# Altium schematic sheet Lightrelayproject.SchDoc
size A; SheetNumber: 1; SheetTotal: 1
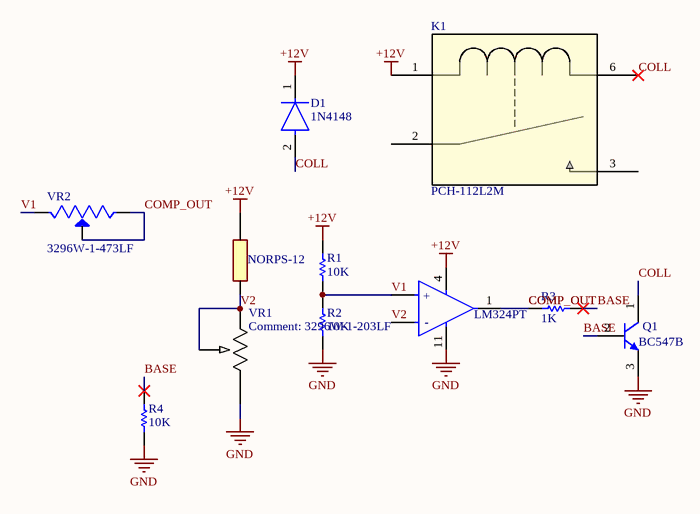
[diagram p0: Lightrelayproject.SchDoc]

## Parts
D1  1N4148  [FP-017AG-MFG]
K1  PCH-112L2M  [RELAY_PCH-1A_TYC]
Q1  BC547B  [ONSC-TO-92-3-29-11]
R1  value 10K  [YAG_CFR25_YAG]  (hidden comment: Resistor)
R2  value 10K  [YAG_CFR25_YAG]  (hidden comment: Resistor)
R3  value 1K  [YAG_CFR25_YAG]  (hidden comment: Resistor)
R4  value 10K  [YAG_CFR25_YAG]  (hidden comment: Resistor)
U1  LM324PT  [FP-TSSOP14-IPC_C]  (part A of 4)
VR1  3296W-1-203LF  [POT_3296W]
VR2  3296W-1-473LF  [TRIM_3296W-1-473LF]
X1  NORPS-12  [NORPS12]

## Nets
+12V: D1.1(C) K1.1 R1.2 U1.4(VCC+) X1.2
GND: Q1.3(E) R2.1 R4.1 U1.11(VCC-) VR1.1
BASE: Q1.2(B) R3.2 R4.2
COLL: D1.2(A) K1.6 Q1.1(C)
COMP_OUT: R3.1 U1.1(Output_1) VR2.1(CCW) VR2.2(WIPER)
V1: R1.1 R2.2 U1.3(Non-inverting_input_1) VR2.3(CW)
V2: U1.2(Inverting_input_1) VR1.2 VR1.3 X1.1

Not connected (* = marked no-connect by the designer): K1 2 3

## Notes on the sheet
- (in symbol CMP-12131-000012-2, part A) +

## Library data of the parts
D1 = CMP-07163-000046-1: DIODE GEN PURP 100V 200MA DO35; Forward Voltage: 1V; Max Power Dissipation: 500mW; Max Reverse Current: 5uA; Forward Current: 300mA; Current: 4A; Reverse Recovery Time: 4ns; Element Configuration: Single; Outside Diameter: 1.85mm; Capacitance: 4pF; Polarity: Standard; Max Forward Surge Current (Ifsm): 1A; Reverse Voltage: 100V; Output Current: 200mA; Average Rectified Current: 200mA; Diameter: 1.91mm; Max Repetitive Reverse Voltage (Vrrm): 100V; Current Rating: 200mA; Case/Package: DO-35; Lead Free: Lead Free; Number of Pins: 2; Recovery Time: 4ns; Packaging: Bulk; Contact Plating: Tin; Voltage: 100V; Mount: Through Hole; Max Surge Current: 4A; Package Quantity: 2000; Width: 1.91mm; Max Reverse Voltage (DC): 100V; Length: 4.56mm; Radiation Hardening: No; Power Dissipation: 500mW; Voltage Rating (DC): 100V; Peak Non-Repetitive Surge Current: 4A; REACH SVHC: No SVHC; Height: 4.56mm; Max Operating Temperature: 175°C; Series: -; Weight: 0.01lb; Min Operating Temperature: -65°C
K1 = PCH-112L2M: Description; Manufacturer_Name: TE Connectivity; Copyright: Copyright (C) 2025 Ultra Librarian. All rights reserved.; Manufacturer_Part_Number: PCH-112L2M; RefDes: RefDes; Type: Type
Q1 = CMP-1048-01467-1: Amplifier Transistor, NPN Silicon, 3-Pin TO-92, Bulk Box; Manufacturer: On Semiconductor; IC Continuous (A): 0.1; fT Min (MHz): 150; DatasheetVersion: Rev. 7; ComponentLink1URL: http://www.onsemi.com/; Polarity: NPN; RoHS: FALSE; ComponentLink1Description: Manufacturer URL; Packing: Bulk Box; PackageDescription: 3-Pin Transistor Outline, Body 4.825 x 3.685 mm, Pitch 1.27 mm; ComponentLink3URL: http://www.onsemi.cn/pub_link/Collateral/2N6426-D.PDF; ComponentLink2Description: Datasheet; PackageVersion: Rev. AM; PackageReference: TO-92-3-29-11_AM_SL; ComponentLink3Description: Package Specification; Mounting Technology: Through Hole; PartNumber: BC547B; ComponentLink2URL: http://www.onsemi.com/pub_link/Collateral/BC546-D.PDF
R1-R4 = Resistor: TC1: 0; SimulationGenericComponent: True; TC2: 0
U1 = CMP-12131-000012-2: IC OPAMP GP 4 CIRCUIT 14TSSOP; Output Current per Channel: 70mA; Max Supply Voltage: 30V; Min Supply Voltage: 3V; Supply Current: 1.2mA; Dual Supply Voltage: 9V; Unity Gain Bandwidth Product: 1.3MHz; Input Offset Voltage (Vos): 7mV; Slew Rate-Nom: 0.4V/µs; Min Dual Supply Voltage: 1.5V; Voltage Gain: 100dB; Number of Circuits: 4; Operating Supply Voltage: 15V; Common Mode Rejection Ratio: 70dB; Operating Supply Current: 1.5mA; Input Offset Voltage-Max: 2mV; Output Current: 40mA; Amplifier Type: GENERAL PURPOSE; Input Bias Current: 150nA; Package Quantity: 2500; Packaging: Tape and Reel; Width: 4.4mm; Series: -; Mount: Surface Mount; RoHS Compliant: Yes; Min Operating Temperature: 0°C; Number of Pins: 14; Length: 5mm; Nominal Supply Current: 1.2mA; Number of Elements: 4; Number of Amplifiers: 4; Max Operating Temperature: 70°C; Case/Package: TSSOP; Height: 1mm; Max Dual Supply Voltage: 15V; Gain Bandwidth Product: 1.3MHz; Number of Channels: 4; Radiation Hardening: No; Bandwidth: 1.3MHz; Slew Rate: 0.4V/µs; Contact Plating: Gold; Lead Free: Lead Free; Technology: BIPOLAR; REACH SVHC: No SVHC
VR1 = 3296W-1-203LF: Description; Manufacturer_Name: Bourns Electronics; Copyright: Copyright (C) 2025 Ultra Librarian. All rights reserved.; Manufacturer_Part_Number: 3296W-1-203LF
VR2 = 3296W-1-473LF: 47 kOhms 0.5W, 1/2W PC Pins Through Hole Trimmer Potentiometer Cermet 25.0 Turn Top Adjustment; MF: Bourns; SnapEDA_Link: https://www.snapeda.com/parts/3296W-1-473LF/Bourns/view-part/?ref=snap; Package: NON STANDARD-3 Bourns; Value: *; MP: 3296W-1-473LF; Check_prices: https://www.snapeda.com/parts/3296W-1-473LF/Bourns/view-part/?ref=eda
X1 = NORPS-12: ADVANCED PHOTONIX - NORPS-12 - LIGHT DEPENDENT RESISTOR,1MOHM,250MW; Geometry.Height: 7mm; Mouser Part Number: 846-NORPS-12; Mouser Price/Stock: https://www.mouser.co.uk/ProductDetail/Advanced-Photonix/NORPS-12?qs=tlsG%2FOw5FFjcOb820GAJtg%3D%3D; Manufacturer_Name: ADVANCED PHOTONIX; Manufacturer_Part_Number: NORPS-12; Datasheet Link: https://componentsearchengine.com/Datasheets/2/NORPS-12.pdf